# Altium schematic sheet Célula 4.SchDoc
size A
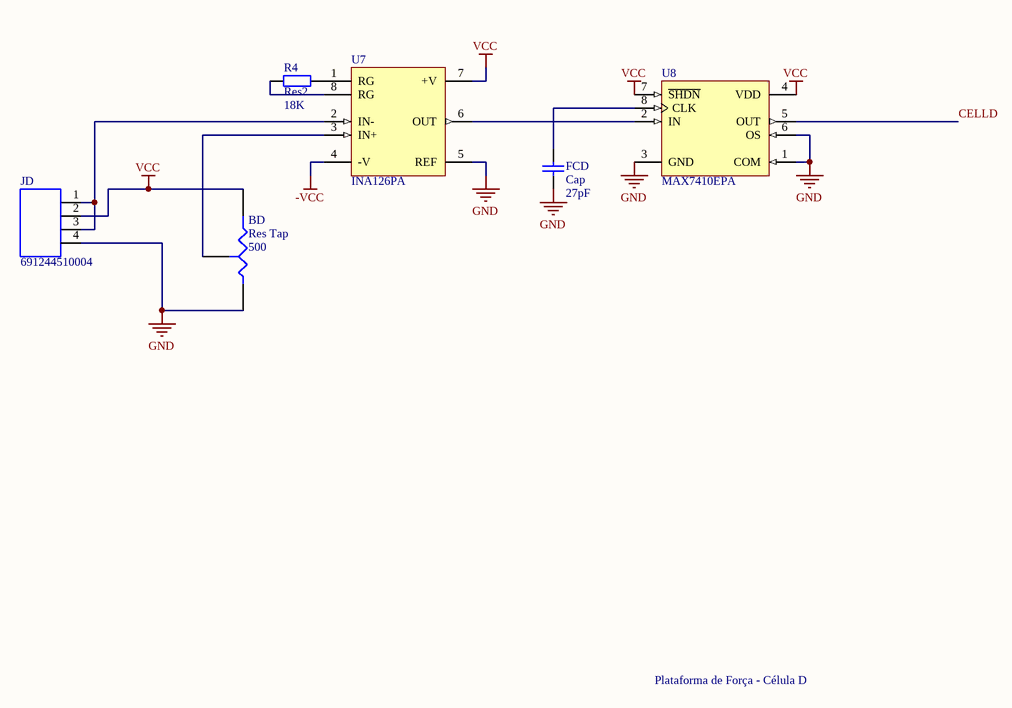
[diagram p0: Célula 4.SchDoc]

## Parts
BD  Res Tap  value 500  [TSR3006]
FCD  Cap  value 27pF  [RAD-0.3]
JD  691244510004  [691244510004]
R4  Res2  value 18K  [AXIAL-0.4]
U7  INA126PA  [006E]
U8  MAX7410EPA  [PA8]

## Nets
-VCC: U7.4(-V)
GND: BD.1(A) FCD.1 JD.4 U7.5(REF) U8.1(COM) U8.3(GND) U8.6(OS)
VCC: BD.2(B) JD.2 U7.7(+V) U8.4(VDD) U8.7(~{SHDN})
CELLD: U8.5(OUT)
NetBD_3: BD.3(TAP) U7.3(IN+)
NetFCD_2: FCD.2 U8.8(CLK)
NetJD_1: JD.1 JD.3 U7.2(IN-)
NetR4_1: R4.1 U7.8(RG)
NetR4_2: R4.2 U7.1(RG)
NetU7_6: U7.6(OUT) U8.2(IN)

## Notes on the sheet
- Plataforma de Força - Célula D

## Library data of the parts
BD = Res Tap: Tapped Resistor; Sim Note: Enter the Resistance value and the set point into parameter fields.; Set Position: 0.5; Published: 24-Mar-1999; LatestRevisionDate: 17-Jul-2002; LatestRevisionNote: Re-released for DXP Platform.; PackageReference: VR3; Publisher: Altium Limited; PackageDescription: Variable Resistor, Thru-Hole; 3 Leads
FCD = Cap: Capacitor; Published: 8-Jun-2000; LatestRevisionDate: 17-Jul-2002; LatestRevisionNote: Re-released for DXP Platform.; PackageReference: RAD-0.3; Publisher: Altium Limited; PackageDescription: Radial Cap, Thru-Hole; 2 Leads; 0.3 in Pin Spacing
JD = 691244510004: WR-TBL Horizontal Cable Entry With Rising Cage Clamp,Serie 2445 - 5.08 mm; Manufacturer: Wurth Elektronik; ComponentLink1 Description: Manufacturer; ComponentLink2 Description: Datasheet; ComponentLink1URL: http://www.we-online.de; ComponentLink2URL: http://katalog.we-online.de/em/datasheet/6912445100XX.pdf; Created by: Baojun Chen; Created Date: 15.Sep.2015; partNo: 691244510004
R4 = Res2: Resistor; Published: 8-Jun-2000; LatestRevisionDate: 17-Jul-2002; LatestRevisionNote: Re-released for DXP Platform.; PackageReference: AXIAL-0.4; Publisher: Altium Limited; PackageDescription: Axial Device, Thru-Hole; 2 Leads; 0.4 in Pin Spacing
U7 = INA126PA: Precision, Low-Power Instrumentation Amplifiers; Published: 8-Jun-2000; LatestRevisionDate: 06-Jun-2005; LatestRevisionNote: Stylized 3D Model Added.; DatasheetVersion: Oct-1996; PackageVersion: revE; PackageReference: 006E; Publisher: Altium Limited; PackageDescription: DIP; 8 Leads; Row Spacing 7.62 mm; Pitch 2.54 mm; ComponentLink1Description: Manufacturer Link; ComponentLink1URL: http://www.ti.com/; ComponentLink2Description: Datasheet; ComponentLink2URL: http://www-s.ti.com/sc/ds/INA128.pdf
U8 = MAX7410EPA: 5th-Order, Lowpass, Switched-Capacitor Filter; Published: 16-Jan-2001; LatestRevisionDate: 29-May-2009; LatestRevisionNote: Component Body Added.; DatasheetVersion: Sep-1998; PackageVersion: RevB, 21-0043; PackageReference: PA8; Publisher: Altium Limited; PackageDescription: DIP, 8-Pin, Row Spacing 7.62 mm, Pitch 2.54 mm; Code_JEDEC: MS-001-AB; ComponentLink1Description: Manufacturer Link; ComponentLink1URL: http://www.maxim-ic.com/; ComponentLink2Description: Datasheet; ComponentLink2URL: http://pdfserv.maxim-ic.com/en/ds/MAX7409-MAX7414.pdf